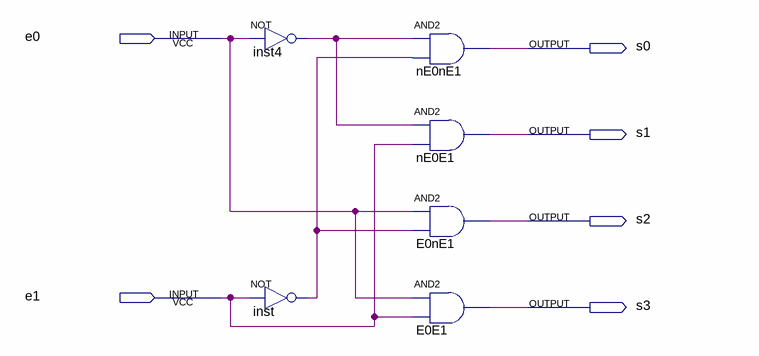
[diagram p0: schematic sheet]
// Quartus schematic decod2x4.bdf as structural Verilog: 6 symbols, 6 pins
module decod2x4 (
  input  e0,
  input  e1,
  output s0,
  output s1,
  output s2,
  output s3
);

  wire inst4_out, inst_out;

  not inst4 (inst4_out, e0);
  not inst (inst_out, e1);
  and nE0nE1 (s0, inst4_out, inst_out);
  and nE0E1 (s1, inst4_out, e1);
  and E0nE1 (s2, e0, inst_out);
  and E0E1 (s3, e0, e1);
endmodule
